# Altium schematic sheet TOP.SchDoc: Chess Board Sensor Array
size A3; DrawnBy: Brandon Skarka; Revision: 0; SheetNumber: 1; SheetTotal: 3
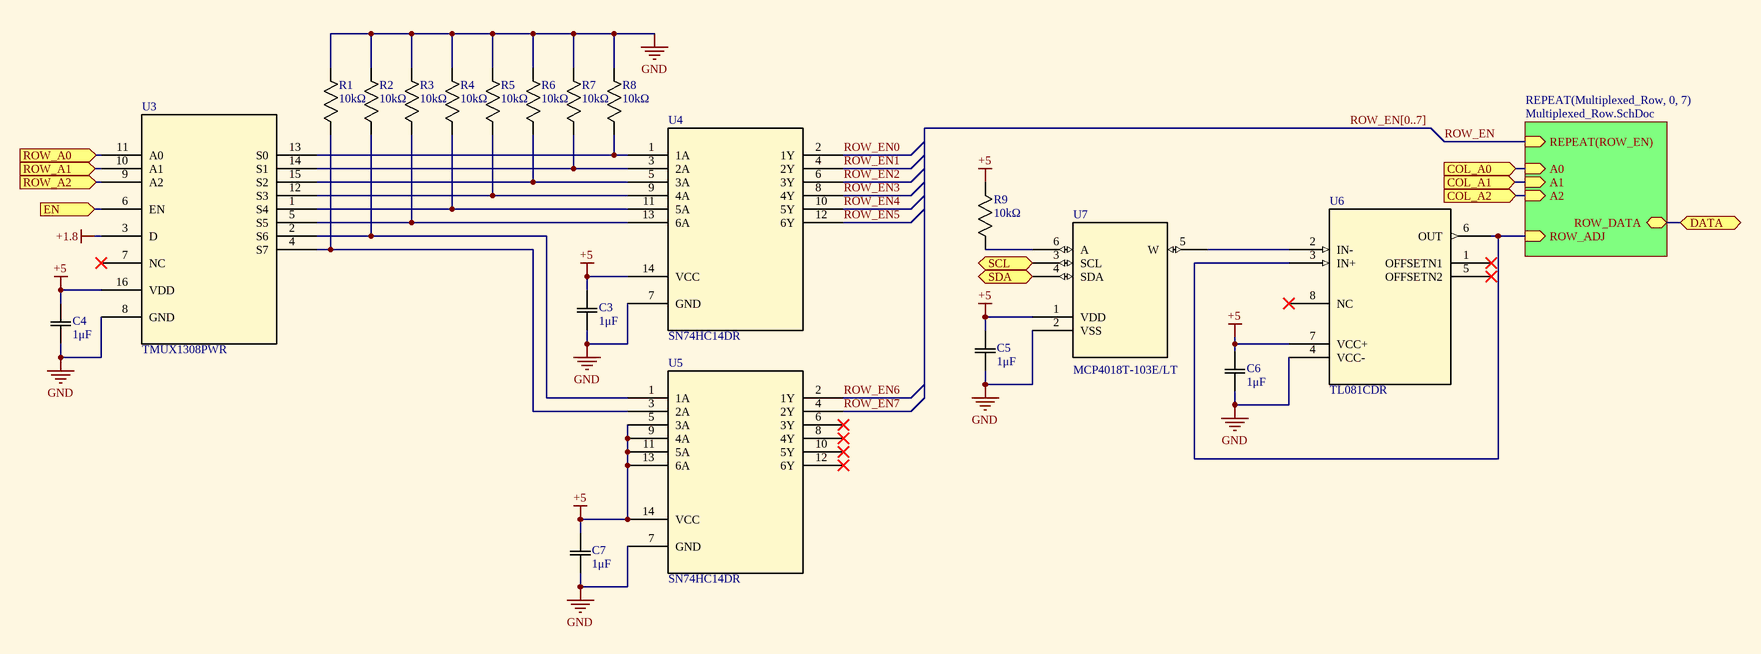
[diagram p0: TOP.SchDoc]

## Parts
C3  1μF  [CAP_CL10_SAM]
C4  1μF  [CAP_CL10_SAM]
C5  1μF  [CAP_CL10_SAM]
C6  1μF  [CAP_CL10_SAM]
C7  1μF  [CAP_CL10_SAM]
R1  10kΩ  [RES_RC0603_YAG]
R2  10kΩ  [RES_RC0603_YAG]
R3  10kΩ  [RES_RC0603_YAG]
R4  10kΩ  [RES_RC0603_YAG]
R5  10kΩ  [RES_RC0603_YAG]
R6  10kΩ  [RES_RC0603_YAG]
R7  10kΩ  [RES_RC0603_YAG]
R8  10kΩ  [RES_RC0603_YAG]
R9  10kΩ  [RES_RC0603_YAG]
U3  TMUX1308PWR  [TSSOP16_PW_TEX]
U4  SN74HC14DR  [D14]
U5  SN74HC14DR  [D14]
U6  TL081CDR  [D8]
U7  MCP4018T-103E/LT  [SC70-6_MC_MCH]

## Sub-sheets
REPEAT(Multiplexed_Row, 0, 7) = Multiplexed_Row.SchDoc: A0 (in), A1 (in), A2 (in), ROW_ADJ (in), REPEAT(ROW_EN) (in), ROW_DATA (bidir)

## Ports
COL_A0 (in), COL_A1 (in), COL_A2 (in), DATA (bidir), EN (in), ROW_A0 (in), ROW_A1 (in), ROW_A2 (in), SCL (bidir), SDA (bidir)

## Nets
+1.8: U3.3(D)
+5: C3.2 C4.2 C5.2 C6.2 C7.2 R9.2 U3.16(VDD) U4.14(VCC) U5.5(3A) U5.9(4A) U5.11(5A) U5.13(6A) U5.14(VCC) U6.7(VCC+) U7.1(VDD)
GND: C3.1 C4.1 C5.1 C6.1 C7.1 R1.2 R2.2 R3.2 R4.2 R5.2 R6.2 R7.2 R8.2 U3.8(GND) U4.7(GND) U5.7(GND) U6.4(VCC-) U7.2(VSS)
COL_A0: port COL_A0, sheet REPEAT(Multiplexed_Row, 0, 7)/A0
COL_A1: port COL_A1, sheet REPEAT(Multiplexed_Row, 0, 7)/A1
COL_A2: port COL_A2, sheet REPEAT(Multiplexed_Row, 0, 7)/A2
DATA: port DATA, sheet REPEAT(Multiplexed_Row, 0, 7)/ROW_DATA
EN: U3.6(EN) ; port EN
ROW_A0: U3.11(A0) ; port ROW_A0
ROW_A1: U3.10(A1) ; port ROW_A1
ROW_A2: U3.9(A2) ; port ROW_A2
ROW_EN: sheet REPEAT(Multiplexed_Row, 0, 7)/REPEAT(ROW_EN)
ROW_EN0: U4.2(1Y)
ROW_EN1: U4.4(2Y)
ROW_EN2: U4.6(3Y)
ROW_EN3: U4.8(4Y)
ROW_EN4: U4.10(5Y)
ROW_EN5: U4.12(6Y)
ROW_EN6: U5.2(1Y)
ROW_EN7: U5.4(2Y)
SCL: U7.3(SCL) ; port SCL
SDA: U7.4(SDA) ; port SDA
NetR1_1: R1.1 U3.4(S7) U5.3(2A)
NetR2_1: R2.1 U3.2(S6) U5.1(1A)
NetR3_1: R3.1 U3.5(S5) U4.13(6A)
NetR4_1: R4.1 U3.1(S4) U4.11(5A)
NetR5_1: R5.1 U3.12(S3) U4.9(4A)
NetR6_1: R6.1 U3.15(S2) U4.5(3A)
NetR7_1: R7.1 U3.14(S1) U4.3(2A)
NetR8_1: R8.1 U3.13(S0) U4.1(1A)
NetR9_1: R9.1 U7.6(A)
NetU6_2: U6.2(IN-) U7.5(W)
NetU6_3: U6.3(IN+) U6.6(OUT) ; sheet REPEAT(Multiplexed_Row, 0, 7)/ROW_ADJ

Not connected (* = marked no-connect by the designer): U3 7(NC)*; U5 6(3Y)* 8(4Y)* 10(5Y)* 12(6Y)*; U6 1(OFFSETN1)* 5(OFFSETN2)* 8(NC)*

## Buses and harness runs
bus ROW_EN[0..7]

## Library data of the parts
C3-C7 = CL10B104KB8NNWC: No Description Available; Mfr_Name: Samsung; Digi-Key_Part_Number_3: 1276-1935-6-ND; Digi-Key_Part_Number_2: 1276-1935-1-ND; Digi-Key_Part_Number_1: 1276-1935-2-ND; Supplier 1: Digi-Key; Supplier Part Number 1: 1276-1935-6-ND; Supplier 2: Mouser; Supplier Part Number 2: 187-CL10B104KB8NNWC
R1-R9 = RC0603FR-7W10KL: No Description Available; Mfr_Name: Yageo; Copyright: Copyright (C) 2023 Ultra Librarian. All rights reserved.; Manufacturer_Part_Number: RC0603FR-7W10KL; RefDes: RefDes; Type: DEV; Supplier 1: Mouser; Supplier Part Number 1: 603-RC0603FR-7W10KL; Supplier 2: Digi-Key; Supplier Part Number 2: 13-RC0603FR-7W10KLCT-ND
U3 = TMUX1308PWR: No Description Available; Mfr_Name: Texas Instruments; RefDes: RefDes; Type: Type; Supplier 1: Mouser; Supplier Part Number 1: 595-TMUX1308PWR; Supplier 2: Digi-Key; Supplier Part Number 2: 296-TMUX1308PWRCT-ND
U4 U5 = SN74HC14DR: No Description Available; Mfr_Name: Texas Instruments; Digi-Key_Part_Number_4: 2156-SN74HC14DR-ND; Digi-Key_Part_Number_3: 296-1194-6-ND; Digi-Key_Part_Number_1: 296-1194-1-ND; Digi-Key_Part_Number_2: 296-1194-2-ND; RefDes: RefDes; Type: Type; Supplier 1: Mouser; Supplier Part Number 1: 595-SN74HC14DR; Supplier 2: Digi-Key; Supplier Part Number 2: 296-1194-1-ND
U6 = TL081CDR: No Description Available; Mfr_Name: Texas Instruments; Copyright: Copyright (C) 2023 Ultra Librarian. All rights reserved.; Manufacturer_Part_Number: TL081CDR; RefDes: RefDes; Type: DEV; Supplier 1: Mouser; Supplier Part Number 1: 595-TL081CDR; Supplier 2: Digi-Key; Supplier Part Number 2: 296-15001-1-ND
U7 = MCP4018T-103ELT: No Description Available; Mfr_Name: Microchip; Copyright: Copyright (C) 2023 Ultra Librarian. All rights reserved.; Manufacturer_Part_Number: MCP4018T-103E/LT; RefDes: RefDes; Type: DEV; Supplier 1: Mouser; Supplier Part Number 1: 579-MCP4018T103E/LT; Supplier 2: Digi-Key; Supplier Part Number 2: MCP4018T-103E/LTCT-ND